# Altium schematic sheet LDO.SchDoc
size 420 x 297 mm; SheetNumber: 3; SheetTotal: 6
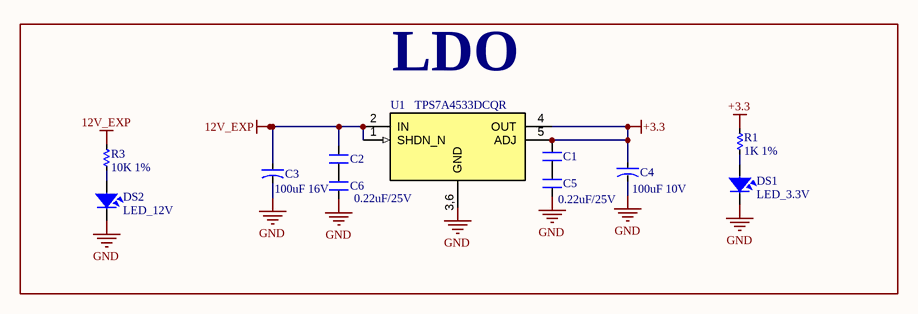
[diagram p0: LDO.SchDoc]

## Parts
C1  0.22uF/25V  [SM-0603]  (value not drawn)
C2  0.22uF/25V  [SM-0603]
C3  100uF 16V  [CAP_TANT_1206]
C4  100uF 10V  [CAP_TANT_1206]
C5  0.22uF/25V  [SM-0603]
C6  0.22uF/25V  [SM-0603]  (value not drawn)
DS1  LED_3.3V  [GREENLED_0603]
DS2  LED_12V  [GREENLED_0603]
R1  1K 1%  [RES-SMD-0603]
R3  10K 1%  [RES-SMD-0603]
U1  TPS7A4533DCQR  [SOT223-6]

## Blocks framed on the sheet
LDO: C1-C6 DS1 DS2 R1 R3 U1

## Nets
12V_EXP: C2.2 C3.1 R3.2 U1.1(SHDN_N) U1.2(IN)
+3.3: C1.2 C4.1 R1.2 U1.4(OUT) U1.5(ADJ)
GND: C3.2 C4.2 C5.1 C6.1 DS1.2 DS2.2 U1.3,6(GND)
NetC1_1: C1.1 C5.2
NetC2_1: C2.1 C6.2
NetDS1_1: DS1.1 R1.1
NetDS2_1: DS2.1 R3.1

## Notes on the sheet
- Project:
- BEE-PC1
- Sub-system:
- Design by:
- Hung Nguyen D.
- Bao Bui Q.
- Sheet title:
- Sheet
- A3
- of
- Checked by:
- Approved by:
- Vu Pham
- Revision:
- Document No:
- V1.2.0
- Size:
- Date:

## Library data of the parts
C1 C2 C5 C6 = CM: 0603; Value: 103
C3 C4 = CN-ALU-SMD: Polarized Capacitor (Axial); Published: 8-Jun-2000; LatestRevisionDate: 17-Jul-2002; LatestRevisionNote: Re-released for DXP Platform.; PackageReference: POLAR0.8; Publisher: Altium Limited
DS1 DS2 = LED SMD: Value: LED 3 - 5 ly 2 Colour
R1 R3 = Res-SMD: 0603; Manufacturer: Generic Components; Class: Passive; Published: 08/06/2000; Publisher: Altium Hobart Technology Centre
U1 = TPS7A4533DCQR: IC REG LINEAR 3.3V 1.5A SOT223-6